# Altium schematic sheet Signel_Input.SchDoc
size A4
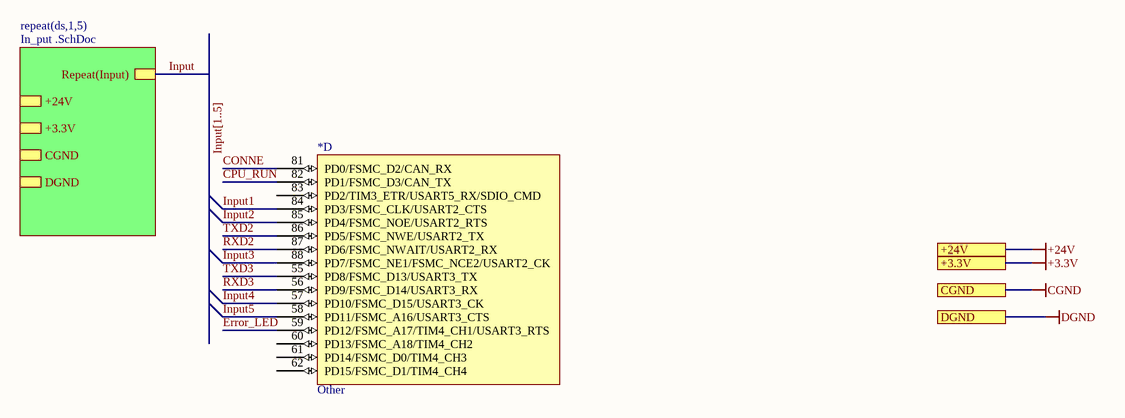
[diagram p0: Signel_Input.SchDoc]

## Parts
*  Other  (part D of 6)

## Sub-sheets
repeat(ds,1,5) = In_put .SchDoc: Repeat(Input), +3.3V, CGND, DGND, +24V

## Ports
+3.3V, +24V, CGND, DGND

## Nets
+3.3V: port +3.3V
+24V: port +24V
CGND: port CGND
DGND: port DGND
CONNE: *.81(PD0/FSMC_D2/CAN_RX)
CPU_RUN: *.82(PD1/FSMC_D3/CAN_TX)
Error_LED: *.59(PD12/FSMC_A17/TIM4_CH1/USART3_RTS)
Input: sheet repeat(ds,1,5)/Repeat(Input)
Input1: *.84(PD3/FSMC_CLK/USART2_CTS)
Input2: *.85(PD4/FSMC_NOE/USART2_RTS)
Input3: *.88(PD7/FSMC_NE1/FSMC_NCE2/USART2_CK)
Input4: *.57(PD10/FSMC_D15/USART3_CK)
Input5: *.58(PD11/FSMC_A16/USART3_CTS)
RXD2: *.87(PD6/FSMC_NWAIT/USART2_RX)
RXD3: *.56(PD9/FSMC_D14/USART3_RX)
TXD2: *.86(PD5/FSMC_NWE/USART2_TX)
TXD3: *.55(PD8/FSMC_D13/USART3_TX)

Not connected (* = marked no-connect by the designer): * 60(PD13/FSMC_A18/TIM4_CH2) 61(PD14/FSMC_D0/TIM4_CH3) 62(PD15/FSMC_D1/TIM4_CH4) 83(PD2/TIM3_ETR/USART5_RX/SDIO_CMD)

## Buses and harness runs
bus Input[1..5]

## Library data of the parts
* = stm32f103vct6